# Altium schematic sheet YYB-Sheet1.SchDoc
size A4
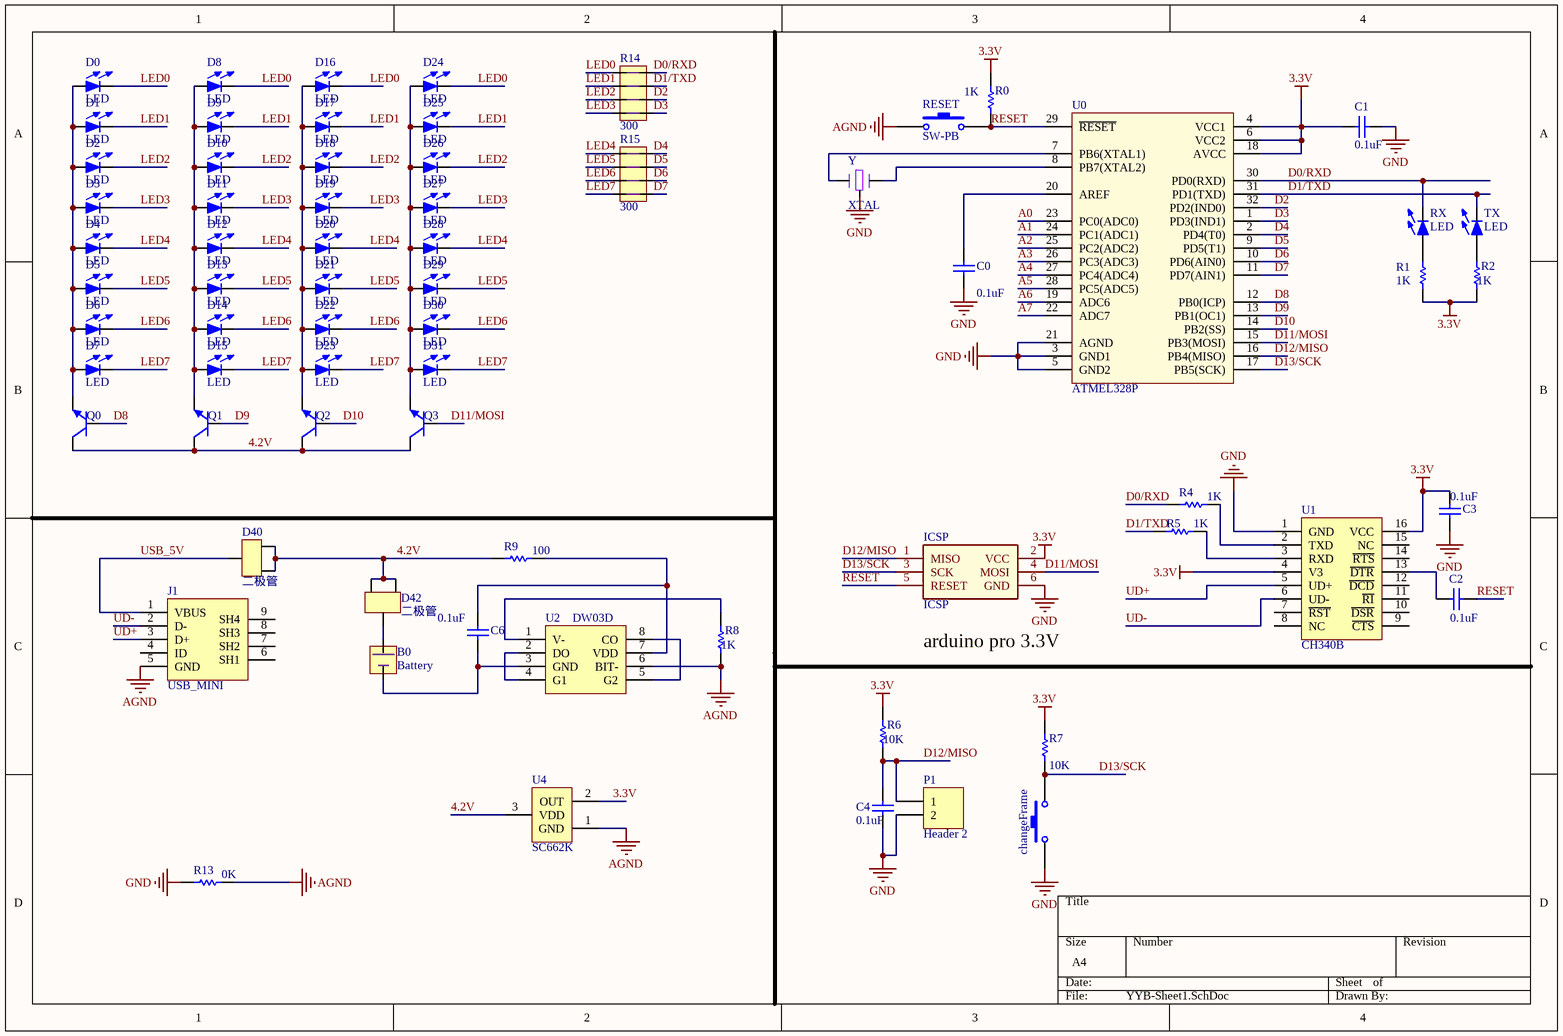
[diagram p0: YYB-Sheet1.SchDoc]

## Parts
B0  Battery  [LI]
C0  value 0.1uF  [6-0805_N]
C1  value 0.1uF  [6-0805_N]  (hidden comment: Cap)
C2  value 0.1uF  [6-0805_N]  (hidden comment: Cap)
C3  value 0.1uF  [6-0805_N]  (hidden comment: Cap)
C4  value 0.1uF  [6-0805_N]  (hidden comment: Cap)
C6  value 0.1uF  [6-0805_N]  (hidden comment: Cap)
changeFrame  SW-PB  [KEY_SODFL_2-Leads]  (value not drawn)
D0  LED  [LED_0805]
D1  LED  [LED_0805]
D2  LED  [LED_0805]
D3  LED  [LED_0805]
D4  LED  [LED_0805]
D5  LED  [LED_0805]
D6  LED  [LED_0805]
D7  LED  [LED_0805]
D8  LED  [LED_0805]
D9  LED  [LED_0805]
D10  LED  [LED_0805]
D11  LED  [LED_0805]
D12  LED  [LED_0805]
D13  LED  [LED_0805]
D14  LED  [LED_0805]
D15  LED  [LED_0805]
D16  LED  [LED_0805]
D17  LED  [LED_0805]
D18  LED  [LED_0805]
D19  LED  [LED_0805]
D20  LED  [LED_0805]
D21  LED  [LED_0805]
D22  LED  [LED_0805]
D23  LED  [LED_0805]
D24  LED  [LED_0805]
D25  LED  [LED_0805]
D26  LED  [LED_0805]
D27  LED  [LED_0805]
D28  LED  [LED_0805]
D29  LED  [LED_0805]
D30  LED  [LED_0805]
D31  LED  [LED_0805]
D40  二极管  [SOT-23]
D42  二极管  [SOT-23]
ICSP  ICSP  [DIP6]
J1  USB_MINI  [MICRO_USB]
P1  Header 2  [HDR1X2]
Q0  transistor  [SOT-23]  (value not drawn)
Q1  transistor  [SOT-23]  (value not drawn)
Q2  transistor  [SOT-23]  (value not drawn)
Q3  transistor  [SOT-23]  (value not drawn)
R0  value 1K  [6-0805_N]
R1  value 1K  [6-0805_N]  (hidden comment: Res1)
R2  value 1K  [6-0805_N]  (hidden comment: Res1)
R4  value 1K  [6-0805_N]  (hidden comment: Res1)
R5  value 1K  [6-0805_N]  (hidden comment: Res1)
R6  value 10K  [6-0805_N]  (hidden comment: Res1)
R7  value 10K  [6-0805_N]  (hidden comment: Res1)
R8  value 1K  [6-0805_N]  (hidden comment: Res1)
R9  value 100  [6-0805_N]  (hidden comment: Res1)
R13  value 0K  [6-0805_N]  (hidden comment: Res1)
R14  300  [0402_Rx4]
R15  300  [0402_Rx4]
RESET  SW-PB  [KEY_SODFL_2-Leads]
RX  LED  [LED_0805]
TX  LED  [LED_0805]
U0  ATMEL328P  [Atmel 328p 5*5]
U1  CH340B  [SOP16]
U2  DW03D  [SOP-8]
U4  SC662K  [SOT-23]
Y  XTAL  [XTAL]

## Nets
3.3V: C1.2 C3.2 ICSP.2(VCC) R0.1 R1.1 R2.1 R6.2 R7.2 U0.4(VCC1) U0.6(VCC2) U0.18(AVCC) U1.4(V3) U1.16(VCC) U4.2(OUT)
AGND: J1.5(GND) R8.1 R13.2 RESET.1 U2.6(BIT-) U4.1(GND)
GND: C0.1 C1.1 C3.1 C4.1 changeFrame.1 ICSP.6(GND) P1.2 R13.1 U0.3(GND1) U0.5(GND2) U0.21(AGND) U1.1(GND) Y.2
4.2V: D40.1 D40.2 D42.1 D42.2 Q0.3(C) Q1.3(C) Q2.3(C) Q3.3(C) R9.1 U4.3(VDD)
A0: U0.23(PC0(ADC0))
A1: U0.24(PC1(ADC1))
A2: U0.25(PC2(ADC2))
A3: U0.26(PC3(ADC3))
A4: U0.27(PC4(ADC4))
A5: U0.28(PC5(ADC5))
A6: U0.19(ADC6)
A7: U0.22(ADC7)
D0/RXD: R4.1 R14.4 RX.2 U0.30(PD0(RXD))
D1/TXD: R5.1 R14.3 TX.2 U0.31(PD1(TXD))
D2: R14.2 U0.32(PD2(IND0))
D3: R14.1 U0.1(PD3(IND1))
D4: R15.8 U0.2(PD4(T0))
D5: R15.7 U0.9(PD5(T1))
D6: R15.6 U0.10(PD6(AIN0))
D7: R15.5 U0.11(PD7(AIN1))
D8: Q0.1(B) U0.12(PB0(ICP))
D9: Q1.1(B) U0.13(PB1(OC1))
D10: Q2.1(B) U0.14(PB2(SS))
D11/MOSI: ICSP.4(MOSI) Q3.1(B) U0.15(PB3(MOSI))
D12/MISO: C4.2 ICSP.1(MISO) P1.1 R6.1 U0.16(PB4(MISO))
D13/SCK: changeFrame.2 ICSP.3(SCK) R7.1 U0.17(PB5(SCK))
LED0: D0.2 D8.2 D16.2 D24.2 R14.5
LED1: D1.2 D9.2 D17.2 D25.2 R14.6
LED2: D2.2 D10.2 D18.2 D26.2 R14.7
LED3: D3.2 D11.2 D19.2 D27.2 R14.8
LED4: D4.2 D12.2 D20.2 D28.2 R15.1
LED5: D5.2 D13.2 D21.2 D29.2 R15.2
LED6: D6.2 D14.2 D22.2 D30.2 R15.3
LED7: D7.2 D15.2 D23.2 D31.2 R15.4
RESET: C2.2 ICSP.5(RESET) R0.2 RESET.2 U0.29(~{RESET})
UD+: J1.3(D+) U1.5(UD+)
UD-: J1.2(D-) U1.6(UD-)
USB_5V: D40.3 J1.1(VBUS)
NetB0_1: B0.1(+) D42.3
NetB0_2: B0.2 C6.1 U2.3(GND)
NetC0_2: C0.2 U0.20(AREF)
NetC2_1: C2.1 U1.13(~{DTR})
NetC6_2: C6.2 R9.2 U2.7(VDD)
NetD0_1: D0.1 D1.1 D2.1 D3.1 D4.1 D5.1 D6.1 D7.1 Q0.2(E)
NetD8_1: D8.1 D9.1 D10.1 D11.1 D12.1 D13.1 D14.1 D15.1 Q1.2(E)
NetD16_1: D16.1 D17.1 D18.1 D19.1 D20.1 D21.1 D22.1 D23.1 Q2.2(E)
NetD24_1: D24.1 D25.1 D26.1 D27.1 D28.1 D29.1 D30.1 D31.1 Q3.2(E)
NetR1_2: R1.2 RX.1
NetR2_2: R2.2 TX.1
NetR4_2: R4.2 U1.2(TXD)
NetR5_2: R5.2 U1.3(RXD)
NetR8_2: R8.2 U2.1(V-)
NetU0_7: U0.7(PB6(XTAL1)) Y.1
NetU0_8: U0.8(PB7(XTAL2)) Y.3
NetU2_2: U2.2(DO) U2.4(G1)
NetU2_5: U2.5(G2) U2.8(CO)

Not connected (* = marked no-connect by the designer): J1 4(ID) 6(SH1) 7(SH2) 8(SH3) 9(SH4); U1 7(~{RST}) 8(NC) 9(~{CTS}) 10(~{DSR}) 11(~{RI}) 12(~{DCD}) 14(~{RTS}) 15(NC)

## Notes on the sheet
- (near ICSP) arduino pro 3.3V

## Library data of the parts
C0-C4 C6 = Cap: Capacitor; Published: 8-Jun-2000; LatestRevisionDate: 17-Jul-2002; LatestRevisionNote: Re-released for DXP Platform.; PackageReference: RAD-0.3; Publisher: Altium Limited; PackageDescription: Radial Cap, Thru-Hole; 2 Leads; 0.3 in Pin Spacing
changeFrame RESET = SW-PB: Switch; Published: 24-Mar-1999; LatestRevisionDate: 17-Jul-2002; LatestRevisionNote: Re-released for DXP Platform.; PackageReference: SPST-2; Publisher: Altium Limited; PackageDescription: Switch; 2 Leads
P1 = Header 2: Header, 2-Pin; LatestRevisionDate: 17-Jul-2002; LatestRevisionNote: Re-released for DXP Platform.; Publisher: Altium Limited
R0-R2 R4-R9 R13 = Res1: Resistor; Published: 8-Jun-2000; LatestRevisionDate: 17-Jul-2002; LatestRevisionNote: Re-released for DXP Platform.; PackageReference: AXIAL-0.3; Publisher: Altium Limited; PackageDescription: Axial Device, Thru-Hole; 2 Leads; 0.3 in Pin Spacing
R14 R15 = ResistorPacks
U0 = ATMEL-328P
U1 = CH340B: usb to uart
U4 = SC662k-3.3V: 3.3V 稳压芯片